# Altium schematic sheet RC522.SchDoc
size A3; SheetNumber: 15; SheetTotal: 17
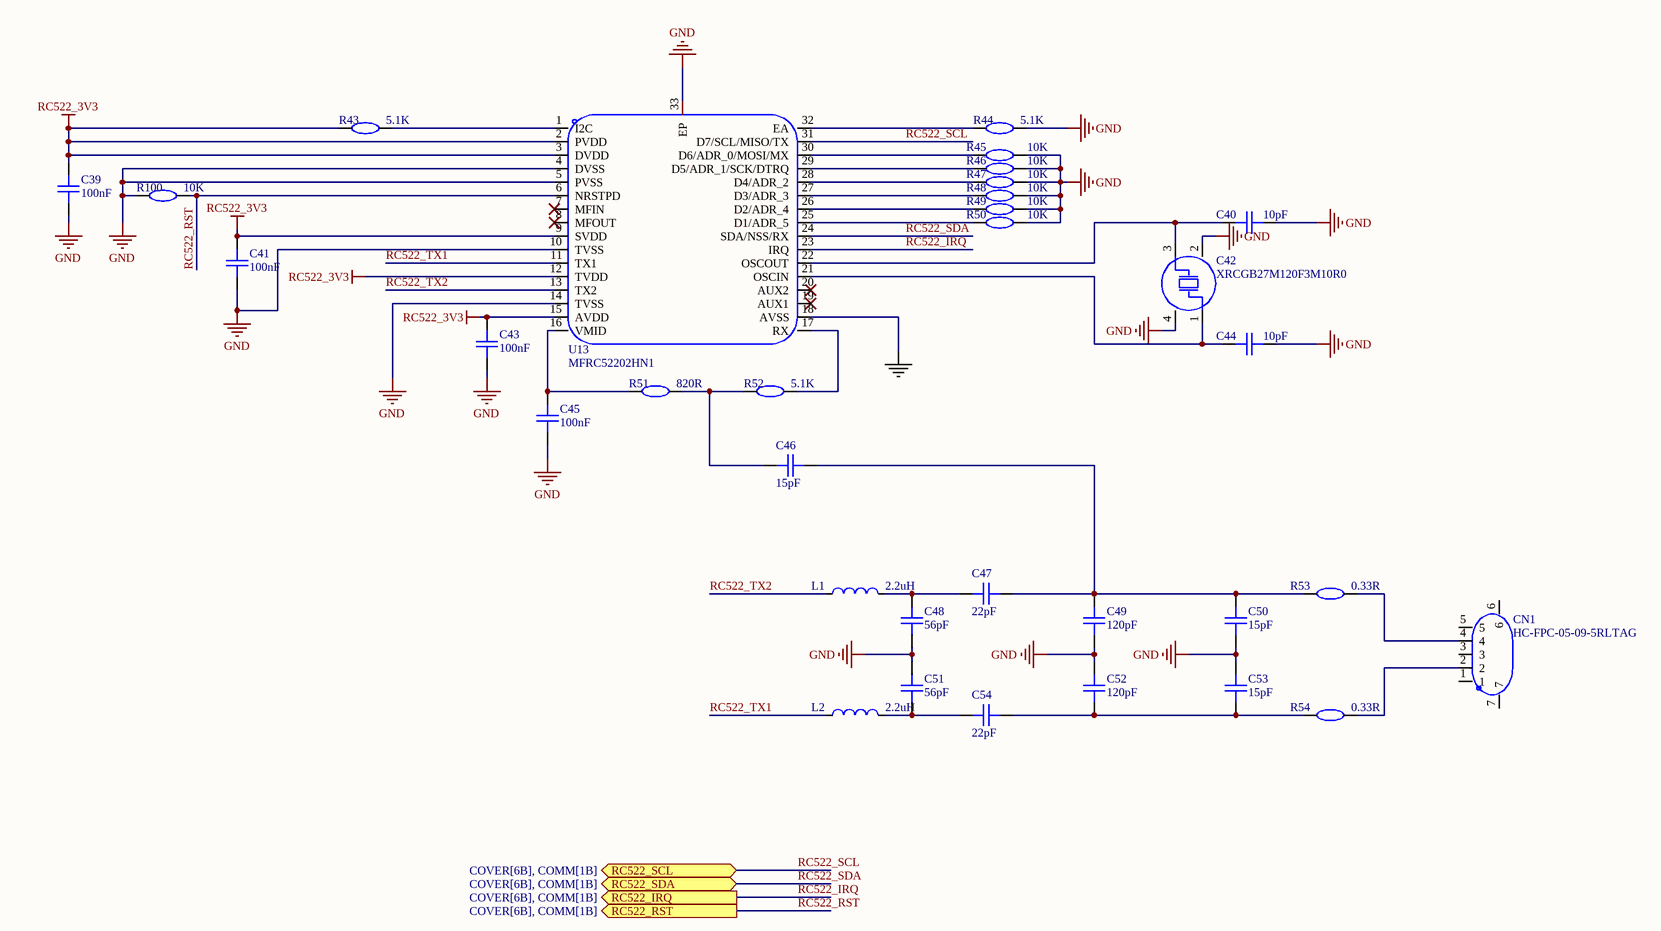
[diagram p0: RC522.SchDoc]

## Parts
C39  100nF  [C0402]
C40  10pF  [C0402]
C41  100nF  [C0402]
C42  XRCGB27M120F3M10R0  [CRYSTAL-SMD_4P-L2.0-W1.6-BL-B]
C43  100nF  [C0402]
C44  10pF  [C0402]
C45  100nF  [C0402]
C46  15pF  [C0402]
C47  22pF  [C0402]
C48  56pF  [C0402]
C49  120pF  [C0402]
C50  15pF  [C0402]
C51  56pF  [C0402]
C52  120pF  [C0402]
C53  15pF  [C0402]
C54  22pF  [C0402]
CN1  HC-FPC-05-09-5RLTAG  [CONN-SMD_5P-P0.50_HCTL_HC-FPC-05-09-5RLTAG]
L1  2.2uH  [L0603]
L2  2.2uH  [L0603]
R43  5.1K  [R0402]
R44  5.1K  [R0402]
R45  10K  [R0402]
R46  10K  [R0402]
R47  10K  [R0402]
R48  10K  [R0402]
R49  10K  [R0402]
R50  10K  [R0402]
R51  820R  [R0402]
R52  5.1K  [R0402]
R53  0.33R  [R0402]
R54  0.33R  [R0402]
R100  10K  [R0402]
U13  MFRC52202HN1  [HVQFN-32_L5.0-W5.0-P0.50-TL-EP3.1]

## Ports
RC522_IRQ (out, see COVER[6B], COMM[1B]), RC522_RST (out, see COVER[6B], COMM[1B]), RC522_SCL (bidir, see COVER[6B], COMM[1B]), RC522_SDA (bidir, see COVER[6B], COMM[1B])

## Nets
GND: C39.1 C40.1 C41.1 C42.2(GND) C42.4(GND) C43.1 C44.1 C45.1 C48.2 C49.1 C50.2 C51.1 C52.2 C53.1 R44.2 R45.2 R46.2 R47.2 R48.2 R49.2 R50.2 R100.1 U13.4(DVSS) U13.5(PVSS) U13.10(TVSS) U13.14(TVSS) U13.18(AVSS) U13.33(EP)
RC522_3V3: C39.2 C41.2 C43.2 R43.1 U13.2(PVDD) U13.3(DVDD) U13.9(SVDD) U13.12(TVDD) U13.15(AVDD)
RC522_IRQ: U13.23(IRQ) ; port RC522_IRQ
RC522_RST: R100.2 U13.6(NRSTPD) ; port RC522_RST
RC522_SCL: U13.31(D7/SCL/MISO/TX) ; port RC522_SCL
RC522_SDA: U13.24(SDA/NSS/RX) ; port RC522_SDA
RC522_TX1: L2.1 U13.11(TX1)
RC522_TX2: L1.1 U13.13(TX2)
NetC40_2: C40.2 C42.3(OSC2) U13.22(OSCOUT)
NetC42_1: C42.1(OSC1) C44.2 U13.21(OSCIN)
NetC45_2: C45.2 R51.1 U13.16(VMID)
NetC46_1: C46.1 C47.2 C49.2 C50.1 R53.1
NetC46_2: C46.2 R51.2 R52.1
NetC47_1: C47.1 C48.1 L1.2
NetC51_2: C51.2 C54.1 L2.2
NetC52_1: C52.1 C53.2 C54.2 R54.1
NetCN1_2: CN1.2 R54.2
NetCN1_4: CN1.4 R53.2
NetR43_2: R43.2 U13.1(I2C)
NetR44_1: R44.1 U13.32(EA)
NetR45_1: R45.1 U13.30(D6/ADR_0/MOSI/MX)
NetR46_1: R46.1 U13.29(D5/ADR_1/SCK/DTRQ)
NetR47_1: R47.1 U13.28(D4/ADR_2)
NetR48_1: R48.1 U13.27(D3/ADR_3)
NetR49_1: R49.1 U13.26(D2/ADR_4)
NetR50_1: R50.1 U13.25(D1/ADR_5)
NetR52_2: R52.2 U13.17(RX)

Not connected (* = marked no-connect by the designer): CN1 1 3 5 6 7; U13 7(MFIN)* 8(MFOUT)* 19(AUX1)* 20(AUX2)*

## Library data of the parts
C39-C41 C43-C54 = CAP_0402: Symbol: CapAcitance; Device: CAP_0603; Convert to PCB: yes; Add into BOM: yes; Supplier Footprint: 0603
  C39 C41 C43 C45: Value: 100nF; Name: 100nF
  C40 C44: Value: 10pF; Name: 10pF
  C46 C50 C53: Value: 15pF; Name: 15pF
  C47 C54: Value: 22pF; Name: 22pF
  C48 C51: Value: 56pF; Name: 56pF
  C49 C52: Value: 120pF; Name: 120pF
C42 = XRCGB27M120F3M10R0: Add into BOM: yes; Symbol: XRCGB27M120F3M10R0; Device: XRCGB27M120F3M10R0; LCSC Part Name: XRCGB27M120F3M10R0; Supplier Part: C9900017793; Manufacturer Part: XRCGB27M120F3M10R0; Supplier Footprint: SMD-4_2016; JLCPCB Part Class: 扩展库; Supplier: LCSC; Convert to PCB: yes; Name: XRCGB27M120F3M10R0
CN1 = HC-FPC-05-09-5RLTAG: Manufacturer: HCTL(华灿天禄); Add into BOM: yes; Locking Feature: 翻盖式; Number of Contacts: 5P; Pitch: 0.5mm; FFC, FCB Thickness: 0.3mm; Symbol: HC-FPC-05-09-5RLTAG; Device: HC-FPC-05-09-5RLTAG; LCSC Part Name: 翻盖式 双侧触点/上下接 P数:5P 间距:0.5mm; Supplier Part: C5213747; Manufacturer Part: HC-FPC-05-09-5RLTAG; Supplier Footprint: SMD,P=0.5mm,卧贴; JLCPCB Part Class: 扩展库; Datasheet: https://atta.szlcsc.com/upload/public/pdf/source/20221026/52A26161A88FCE07A06989F8D4399614.pdf; Supplier: LCSC; Convert to PCB: yes; Contact Type: 双侧触点/上下接; Mounting Type: 卧贴; Height Above Board: 1mm; Contact Material: 铜合金; Operating Temperature Range: -55℃~+85℃; Name: HC-FPC-05-09-5RLTAG
L1 L2 = L_0603: Symbol: SDFL1608S100KTF; Add into BOM: yes; Device: L_0603; Supplier Footprint: L0603; Convert to PCB: yes; Value: 2.2uH; Name: 2.2uH
R43-R54 R100 = Res_0402: Symbol: 电阻; Device: Res_0603; Convert to PCB: yes; Add into BOM: yes; Supplier Footprint: 0603
  R43 R44 R52: Value: 5.1K; Name: 5.1K
  R45-R50 R100: Value: 10K; Name: 10K
  R51: Value: 820R; Name: 820R
  R53 R54: Value: 0.33R; Name: 0.33R
U13 = MFRC52202HN1: Manufacturer: NXP(恩智浦); Add into BOM: yes; Symbol: MFRC52202HN1; Device: MFRC52202HN1; LCSC Part Name: MFRC52202HN1; Supplier Part: C843830; Manufacturer Part: MFRC52202HN1; Supplier Footprint: HVQFN-32-EP(5x5); JLCPCB Part Class: 扩展库; Datasheet: https://atta.szlcsc.com/upload/public/pdf/source/20210612/7E057865B518E13EE9A01435AD863201.pdf; Supplier: LCSC; Convert to PCB: yes; Name: MFRC52202HN1